# Altium project loapay_test.PrjPcb
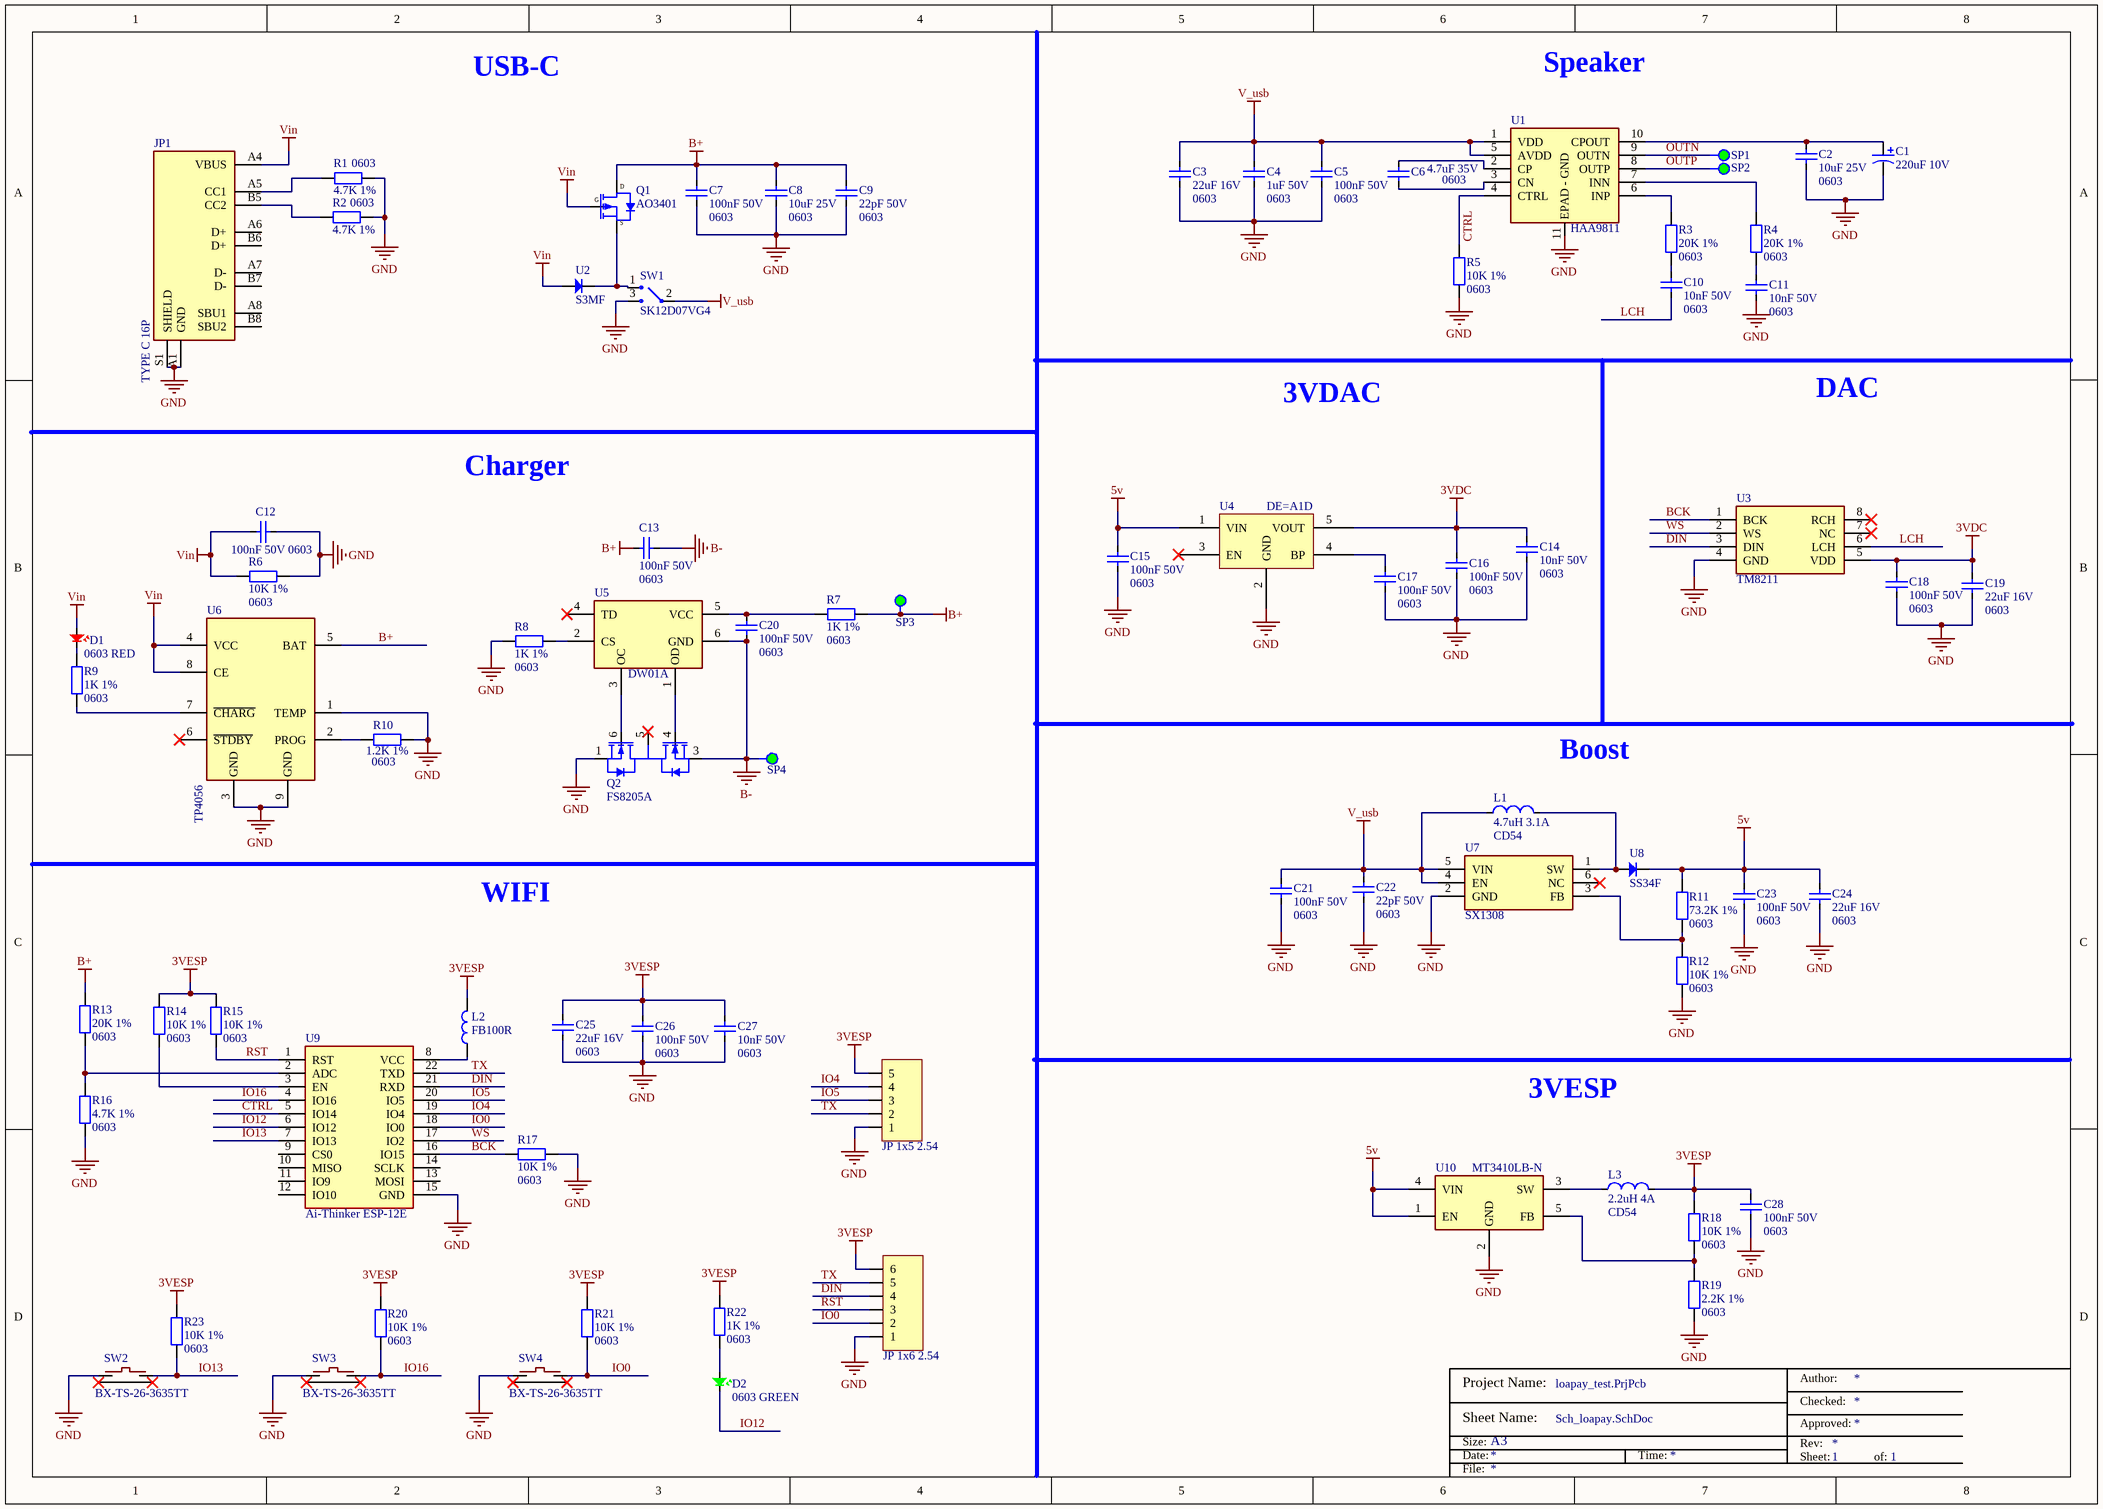
[diagram p0: Sch_loapay.SchDoc]
1 sheet, 79 parts. Net scope: global (net labels, ports and power ports of the same name join across sheets).
Board file: Pcb_loapay.PcbDoc

## Sheet Sch_loapay.SchDoc
size A3; SheetNumber: 1; SheetTotal: 1

### Parts
C1  220uF 10V  [CAP-ALU-SMD-D-NEW]
C2  10uF 25V  Package: 0603  [C0603]
C3  22uF 16V  Package: 0603  [C0603]
C4  1uF 50V  Package: 0603  [C0603]
C5  100nF 50V  Package: 0603  [C0603]
C6  4.7uF 35V  Package: 0603  [C0603]
C7  100nF 50V  Package: 0603  [C0603]
C8  10uF 25V  Package: 0603  [C0603]
C9  22pF 50V  Package: 0603  [C0603]
C10  10nF 50V  Package: 0603  [C0603]
C11  10nF 50V  Package: 0603  [C0603]
C12  100nF 50V  Package: 0603  [C0603]
C13  100nF 50V  Package: 0603  [C0603]
C14  10nF 50V  Package: 0603  [C0603]
C15  100nF 50V  Package: 0603  [C0603]
C16  100nF 50V  Package: 0603  [C0603]
C17  100nF 50V  Package: 0603  [C0603]
C18  100nF 50V  Package: 0603  [C0603]
C19  22uF 16V  Package: 0603  [C0603]
C20  100nF 50V  Package: 0603  [C0603]
C21  100nF 50V  Package: 0603  [C0603]
C22  22pF 50V  Package: 0603  [C0603]
C23  100nF 50V  Package: 0603  [C0603]
C24  22uF 16V  Package: 0603  [C0603]
C25  22uF 16V  Package: 0603  [C0603]
C26  100nF 50V  Package: 0603  [C0603]
C27  10nF 50V  Package: 0603  [C0603]
C28  100nF 50V  Package: 0603  [C0603]
D1  0603 RED  [LED0603_RED]
D2  0603 GREEN  [LED0603_GREEN]
JP1  TYPE C 16P  [TYPE C 16P]
JP2  JP 1x5 2.54  [JP 1x5 DT]
JP3  JP 1x6 2.54  [JP 1x6 DT]
L1  4.7uH 3.1A  [CD54]
L2  FB100R  [L-INDUCTOR 1206]
L3  2.2uH 4A  [CD54]
Q1  AO3401  [SOT-23-3]
Q2  FS8205A  [SOT23-6]
R1  4.7K 1%  Package: 0603  [RES_SMD_0603]
R2  4.7K 1%  Package: 0603  [RES_SMD_0603]
R3  20K 1%  Package: 0603  [RES_SMD_0603]
R4  20K 1%  Package: 0603  [RES_SMD_0603]
R5  10K 1%  Package: 0603  [RES_SMD_0603]
R6  10K 1%  Package: 0603  [RES_SMD_0603]
R7  1K 1%  Package: 0603  [RES_SMD_0603]
R8  1K 1%  Package: 0603  [RES_SMD_0603]
R9  1K 1%  Package: 0603  [RES_SMD_0603]
R10  1.2K 1%  Package: 0603  [RES_SMD_0603]
R11  73.2K 1%  Package: 0603  [RES_SMD_0603]
R12  10K 1%  Package: 0603  [RES_SMD_0603]
R13  20K 1%  Package: 0603  [RES_SMD_0603]
R14  10K 1%  Package: 0603  [RES_SMD_0603]
R15  10K 1%  Package: 0603  [RES_SMD_0603]
R16  4.7K 1%  Package: 0603  [RES_SMD_0603]
R17  10K 1%  Package: 0603  [RES_SMD_0603]
R18  10K 1%  Package: 0603  [RES_SMD_0603]
R19  2.2K 1%  Package: 0603  [RES_SMD_0603]
R20  10K 1%  Package: 0603  [RES_SMD_0603]
R21  10K 1%  Package: 0603  [RES_SMD_0603]
R22  1K 1%  Package: 0603  [RES_SMD_0603]
R23  10K 1%  Package: 0603  [RES_SMD_0603]
SP1  SP  [SOLDERING PAD BIG 2]  (value not drawn)
SP2  SP  [SOLDERING PAD BIG 2]  (value not drawn)
SP3  SP  [SOLDERING PAD BIG 2]  (value not drawn)
SP4  SP  [SOLDERING PAD BIG 2]  (value not drawn)
SW1  SK12D07VG4  [SK12D07VG4]
SW2  BX-TS-26-3635TT  [BX-TS-26-3635TT]
SW3  BX-TS-26-3635TT  [BX-TS-26-3635TT]
SW4  BX-TS-26-3635TT  [BX-TS-26-3635TT]
U1  HAA9811  [ESOP-10]
U2  S3MF  [SMAF_L3.5-W2.6-LS4.7-RD]
U3  TM8211  [SOIC-8]
U4  DE=A1D  [SOT95P260X135-5N]
U5  DW01A  [SOT23-6]
U6  TP4056  [ESOP-8]
U7  SX1308  [SOT23-6]
U8  SS34F  [SMAF_L3.5-W2.6-LS4.7-RD]
U9  Ai-Thinker ESP-12E  [ESP8266-12E]
U10  MT3410LB-N  [SOT23_5]

### Nets
3VDC: C14.2 C16.2 C18.2 C19.2 U3.5(VDD) U4.5(VOUT)
3VESP: C25.2 C26.2 C27.2 C28.2 JP2.5 JP3.6 L2.2 L3.2 R14.1 R15.1 R18.2 R20.1 R21.1 R22.2 R23.1
5v: C15.2 C23.2 C24.2 R11.2 U4.1(VIN) U8.1 U10.1(EN) U10.4(VIN)
B+: C7.2 C8.2 C9.2 C13.1 Q1.3(D) R7.1 R13.2 SP3.1 U6.5(BAT)
B-: C13.2 C20.1 Q2.3(S2) SP4.1 U5.6(GND)
GND: C1.2 C2.1 C3.1 C4.1 C5.1 C7.1 C8.1 C9.1 C11.1 C12.2 C14.1 C15.1 C16.1 C17.1 C18.1 C19.1 C21.1 C22.1 C23.1 C24.1 C25.1 C26.1 C27.1 C28.1 JP1.A1(GND) JP1.S1(SHIELD) JP2.1 JP3.1 Q2.1(S1) R1.2 R2.2 R5.1 R6.2 R8.2 R10.2 R12.1 R16.1 R17.1 R19.1 SW1.3 SW2.1 SW3.1 SW4.1 U1.11(EPAD_-_GND) U3.4(GND) U4.2(GND) U6.1(TEMP) U6.3(GND) U6.9(GND) U7.2(GND) U9.15(GND) U10.2(GND)
V_usb: C3.2 C4.2 C5.2 C21.2 C22.2 L1.1 SW1.2 U1.1(VDD) U1.5(AVDD) U7.4(EN) U7.5(VIN)
Vin: C12.1 D1.1 JP1.A4(VBUS) Q1.1(G) R6.1 U2.2 U6.4(VCC) U6.8(CE)
BCK: R17.2 U3.1(BCK) U9.16(IO15)
CTRL: R5.2 U1.4(CTRL) U9.5(IO14)
DIN: JP3.4 U3.3(DIN) U9.21(RXD)
IO0: JP3.2 R21.2 SW4.2 U9.18(IO0)
IO4: JP2.4 U9.19(IO4)
IO5: JP2.3 U9.20(IO5)
IO12: D2.2 U9.6(IO12)
IO13: R23.2 SW2.2 U9.7(IO13)
IO16: R20.2 SW3.2 U9.4(IO16)
LCH: C10.1 U3.6(LCH)
OUTN: SP1.1 U1.9(OUTN)
OUTP: SP2.1 U1.8(OUTP)
RST: JP3.3 R15.2 U9.1(RST)
TX: JP2.2 JP3.5 U9.22(TXD)
WS: U3.2(WS) U9.17(IO2)
NetC1_1: C1.1 C2.2 U1.10(CPOUT)
NetC6_1: C6.1 U1.3(CN)
NetC6_2: C6.2 U1.2(CP)
NetC10_2: C10.2 R3.1
NetC11_2: C11.2 R4.1
NetC17_2: C17.2 U4.4(BP)
NetC20_2: C20.2 R7.2 U5.5(VCC)
NetD1_2: D1.2 R9.2
NetD2_1: D2.1 R22.1
NetJP1_A5: JP1.A5(CC1) R1.1
NetJP1_B5: JP1.B5(CC2) R2.1
NetL1_2: L1.2 U7.1(SW) U8.2
NetL2_1: L2.1 U9.8(VCC)
NetL3_1: L3.1 U10.3(SW)
NetQ1_2: Q1.2(S) SW1.1 U2.1
NetQ2_4: Q2.4(G2) U5.1(OD)
NetQ2_6: Q2.6(G1) U5.3(OC)
NetR3_2: R3.2 U1.6(INP)
NetR4_2: R4.2 U1.7(INN)
NetR8_1: R8.1 U5.2(CS)
NetR9_1: R9.1 U6.7(~{CHARG})
NetR10_1: R10.1 U6.2(PROG)
NetR11_1: R11.1 R12.2 U7.3(FB)
NetR13_1: R13.1 R16.2 U9.2(ADC)
NetR14_2: R14.2 U9.3(EN)
NetR18_1: R18.1 R19.2 U10.5(FB)

Not connected (* = marked no-connect by the designer): JP1 A6(D+) A7(D-) A8(SBU1) B6(D+) B7(D-) B8(SBU2); Q2 5(D1/D2)*; SW2 3* 4*; SW3 3* 4*; SW4 3* 4*; U3 7(NC)* 8(RCH)*; U4 3(EN)*; U5 4(TD)*; U6 6(~{STDBY})*; U7 6(NC)*; U9 9(CS0) 10(MISO) 11(IO9) 12(IO10) 13(MOSI) 14(SCLK)

### Notes on the sheet
- USB-C
- Speaker
- 3VDAC
- DAC
- Charger
- (near L1) Boost
- WIFI
- 3VESP
- Project Name:
- Author:
- Size:
- Date:
- Sheet Name:
- A3
- Time:
- Checked:
- Approved:
- Rev:
- Sheet:
- of:
- File:

### Library data of the parts
C1 = C_ALU_220uF_10V_D: 220uF 10V ±20% SMD,D6.3xL7.7mm Aluminum Electrolytic Capacitors - SMD ROHS; Manufacturer: Honor Elec; Manufacture Part Number: RVT1A221M0607; Packaging: Cut Tape; Link: https://www.lcsc.com/product-detail/Aluminum-Electrolytic-Capacitors-SMD_Honor-Elec-RVT1A221M0607_C87859.html?s_z=n_220uF; Package: D
C2 C8 = C0603_MLCC_10uF_25V: 25V 10uF X5R ±10% 0603 Multilayer Ceramic Capacitors MLCC - SMD/SMT ROHS; Manufacturer: Murata Electronics; Manufacture Part Number: GRM188R61E106KA73D; Packaging: Cut Tape (CT); Link: https://www.lcsc.com/product-detail/Multilayer-Ceramic-Capacitors-MLCC-SMD-SMT_Murata-Electronics-GRM188R61E106KA73D_C344022.html?s_z=n_10uF%2050V%200603
C3 C19 C24 C25 = C0603_MLCC_22uF_16V: 16V 22uF X5R ±20% 0603 Multilayer Ceramic Capacitors MLCC - SMD/SMT ROHS; Manufacturer: Samsung Electro-Mechanics; Manufacture Part Number: CL10A226MO7JZNC; Packaging: Cut Tape (CT); Link: https://www.lcsc.com/product-detail/Multilayer-Ceramic-Capacitors-MLCC-SMD-SMT_Samsung-Electro-Mechanics-CL10A226MO7JZNC_C2762594.html?s_z=n_22uF%2050V%200603
C4 = C0603_MLCC_1uF_50V: 1 µF ±10% 50V Ceramic Capacitor X5R 0603 (1608 Metric); Manufacturer: Murata Electronics; Manufacture Part Number: GRT188R61H105KE13D; Packaging: Cut Tape (CT); Link: https://www.digikey.com/en/products/detail/murata-electronics/GRT188R61H105KE13D/5416752
C5 C7 C12 C13 C15-C18 C20 C21 C23 C26 C28 = C0603_MLCC_100nF_50V: 50V 100nF X7R ±10% 0603 Multilayer Ceramic Capacitors MLCC - SMD/SMT ROHS; Manufacturer: YAGEO; Manufacture Part Number: CC0603KRX7R9BB104; Packaging: Cut Tape (CT); Link: https://www.lcsc.com/product-detail/Multilayer-Ceramic-Capacitors-MLCC-SMD-SMT_YAGEO-CC0603KRX7R9BB104_C14663.html?s_z=n_100nF%2050V%200603
C6 = C0603_MLCC_4.7uF_35V: 35V 4.7uF X5R ±10% 0603 Multilayer Ceramic Capacitors MLCC - SMD/SMT ROHS; Manufacturer: TDK; Manufacture Part Number: C1608X5R1V475KT000E; Packaging: Cut Tape (CT); Link: https://www.lcsc.com/product-detail/Multilayer-Ceramic-Capacitors-MLCC-SMD-SMT_TDK-C1608X5R1V475KT000E_C329940.html?s_z=n_4.7uF%2050V%200603
C9 C22 = C0603_MLCC_22pF_50V: 50V 22pF NP0 ±5% 0603 Multilayer Ceramic Capacitors MLCC - SMD/SMT ROHS; Manufacturer: YAGEO; Manufacture Part Number: CC0603JRNPO9BN220; Packaging: Cut Tape (CT); Link: https://www.lcsc.com/product-detail/Multilayer-Ceramic-Capacitors-MLCC-SMD-SMT_YAGEO-CC0603JRNPO9BN220_C105620.html?s_z=n_22pF%2050V%200603
C10 C11 C14 C27 = C0603_MLCC_10nF_50V: 50V 10nF X7R ±10% 0603 Multilayer Ceramic Capacitors MLCC - SMD/SMT ROHS; Manufacturer: YAGEO; Manufacture Part Number: CC0603KRX7R9BB103; Packaging: Cut Tape (CT); Link: https://www.lcsc.com/product-detail/Multilayer-Ceramic-Capacitors-MLCC-SMD-SMT_YAGEO-CC0603KRX7R9BB103_C100042.html?s_z=n_10nF%2050V%200603
D1 = L0603_RED: 20mA 330mcd Colorless Transparent Lens -20℃~+85℃ Positive Stick 620nm~630nm Red 120° 50mW 2.3V 0603 LED Indication - Discrete ROHS; Manufacturer: XINGLIGHT; Manufacture Part Number: XL-1608SURC-06; Packaging: Cut Tape (CT); Link: https://www.lcsc.com/product-detail/LED-Indication-Discrete_XINGLIGHT-XL-1608SURC-06_C965799.html?s_z=n_LED%200603%20red; Package: 0603
D2 = L0603_GREEN: 225mcd~450mcd Colorless Transparent Lens -40℃~+85℃ Positive Stick 520nm~535nm Green 120° 70mW 2.4V~3V 0603 LED Indication - Discrete ROHS; Manufacturer: Amicc; Manufacture Part Number: A-SP192DGHC-C01-4T; Packaging: Cut Tape (CT); Link: https://www.lcsc.com/product-detail/LED-Indication-Discrete_Amicc-A-SP192DGHC-C01-4T_C19171301.html?s_z=n_LED%200603%20green; Package: 0603
JP1 = TYPE_C_16P: USB-C (USB TYPE-C) USB 2.0 Receptacle Connector 24 (16+8 Dummy) Position Surface Mount, Right Angle; Through Hole; Manufacturer: Amphenol ICC (Commercial Products); Manufacture Part Number: 12402012E212A; Packaging: Cut Tape; Link: https://www.digikey.cn/en/products/detail/amphenol-cs-commercial-products/12402012E212A/13683192; Package: Plugin
JP2 = JP 1x5 2.54 Duc Thang: Cắm; Ten_Linh_Kien: Jump Đơn Đực 2.54MM 1x40P Thẳng 11MM; Don_Vi: Con; Ma_Hang: MH000903; Ghi_Chu: *; Kieu_Chan: *; Chung_Loai: Cắm
JP3 = JP 1x6 2.54 Duc Thang: Cắm; Ten_Linh_Kien: Jump Đơn Đực 2.54MM 1x40P Thẳng 11MM; Don_Vi: Con; Ma_Hang: MH000903; Ghi_Chu: *; Kieu_Chan: *; Chung_Loai: Cắm
L1 = CD54_4.7uH_3.1A: 3.1A 4.7uH ±20% SMD,5.8x5.2mm Power Inductors ROHS; Manufacturer: Ceaiya; Manufacture Part Number: CD54-4R7M; Packaging: Cut Tape; Link: https://www.lcsc.com/product-detail/Power-Inductors_Ceaiya-CD54-4R7M_C7588991.html?s_z=n_cd54%204.7uH; Inductor: 4.7uH; Current: 3.1A; Package: CD54
L2 = L-Inductor
L3 = CD54_2.2uH_4A: 4A 2.2uH ±20% SMD,5.8x5.2mm Power Inductors ROHS; Manufacturer: Ceaiya; Manufacture Part Number: CD54-2R2M; Packaging: Cut Tape; Link: https://www.lcsc.com/product-detail/Power-Inductors_Ceaiya-CD54-2R2M_C7588989.html?s_z=n_cd54%202.2uH; Inductor: 2.2uH; Current: 4A; Package: CD54
Q1 = AO3401: 30V 4.2A 42mΩ@10V,4A 1.4W 800mV@250uA 1 Piece P-Channel SOT-23 MOSFETs ROHS; Manufacturer: ElecSuper; Manufacture Part Number: AO3401; Packaging: Cut Tape (CT); Link: https://www.lcsc.com/product-detail/MOSFETs_ElecSuper-AO3401_C5224195.html; Drain Source Voltage (Vdss): 30V; Continuous Drain Current (Id): 4.2A; Power Dissipation (Pd): 1.4W; Package: SOT-23-3
Q2 = FS8205A: 20V 25mΩ@2.5V,3A 1.5W 500mV SOT-23-6 MOSFETs ROHS; Manufacturer: TECH PUBLIC; Manufacture Part Number: FS8205A; Packaging: Cut Tape (CT); Link: https://www.lcsc.com/product-detail/MOSFETs_TECH-PUBLIC-FS8205A_C2830320.html?s_z=n_fs8205; Drain to Source Voltage: 20V; RDS(on): 25mΩ@2.5V,3A; Gate Threshold Voltage (Vgs(th)@Id): 500mV; Package: SOT-23-6
R1 R2 R16 = R0603_4.7K: 4.7 kOhms ±1% 0.1W, 1/10W Chip Resistor 0603 (1608 Metric) Moisture Resistant Thick Film; Manufacturer: YAGEO; Manufacture Part Number: RC0603FR-074K7L; Packaging: Cut Tape (CT); Link: https://www.digikey.com/en/products/detail/yageo/RC0603FR-074K7L/727212
R3 R4 R13 = R0603_20K: 20 kOhms ±1% 0.063W, 1/16W Chip Resistor 0402 (1005 Metric) Moisture Resistant Thick Film; Manufacturer: YAGEO; Manufacture Part Number: RC0805FR-0720KL; Packaging: Cut Tape (CT); Link: https://www.digikey.com/en/products/detail/yageo/RC0805FR-0720KL/727720
R5 R6 R12 R14 R15 R17 R18 R20 R21 R23 = R0603_10K: 10 kOhms ±1% 0.1W, 1/10W Chip Resistor 0603 (1608 Metric) Moisture Resistant Thick Film; Manufacturer: YAGEO; Manufacture Part Number: RC0603FR-0710KL; Packaging: Cut Tape (CT); Link: https://www.digikey.com/en/products/detail/yageo/RC0603FR-0710KL/726880
R7-R9 R22 = R0603_1K: 1 kOhms ±1% 0.1W, 1/10W Chip Resistor 0603 (1608 Metric) Moisture Resistant Thick Film; Manufacturer: YAGEO; Manufacture Part Number: RC0603FR-071KL; Packaging: Cut Tape (CT); Link: https://www.digikey.com/en/products/detail/yageo/RC0603FR-071KL/726843
R10 = R0603_1.2K: 1.2 kOhms ±1% 0.1W, 1/10W Chip Resistor 0603 (1608 Metric) Moisture Resistant Thick Film; Manufacturer: YAGEO; Manufacture Part Number: RC0603FR-071K2L; Packaging: Cut Tape (CT); Link: https://www.digikey.com/en/products/detail/yageo/RC0603FR-071K2L/726852
R11 = R0603_73.2K: 73.2 kOhms ±1% 0.1W, 1/10W Chip Resistor 0603 (1608 Metric) Moisture Resistant Thick Film; Manufacturer: YAGEO; Manufacture Part Number: RC0603FR-0773K2L; Packaging: Cut Tape (CT); Link: 73.2 kOhms ±1% 0.1W, 1/10W Chip Resistor 0603 (1608 Metric) Moisture Resistant Thick Film
R19 = R0603_2.2K: 2.2 kOhms ±1% 0.1W, 1/10W Chip Resistor 0603 (1608 Metric) Moisture Resistant Thick Film; Manufacturer: YAGEO; Manufacture Part Number: RC0603FR-072K2L; Packaging: Cut Tape (CT); Link: https://www.digikey.com/en/products/detail/yageo/RC0603FR-072K2L/727016
SP1-SP4 = SOLDERING PAD
SW1 = SK12D07VG4: 500mA SPDT 50V 5千次 Plugin Slide Switches ROHS; Manufacturer: SHOU HAN; Manufacture Part Number: SK12D07VG4; Link: https://www.lcsc.com/product-detail/Slide-Switches_SHOU-HAN-SK12D07VG4_C393937.html; Package: Plugin
SW2-SW4 = BX-TS-26-3635TT: Without bracket 50mA 3.6mm 100000 Times 260gf 12V 3.5mm 3.5mm Rectangle button Standing paste SPST SMD,3x6mm Tactile Switches ROHS; Manufacturer: Bossie; Manufacture Part Number: C18078107; Packaging: Cut Tape; Link: https://www.lcsc.com/product-detail/Tactile-Switches_Bossie-BX-TS-26-3635TT_C18078107.html?s_z=n_tactile; Package: SMD,3x6mm
U1 = HAA9811: Amplifier; Manufacturer: ChipSourceTek Technology; Manufacture Part Number: HAA9811; Packaging: Cut Tape (CT); Package: ESOP-10
U2 = S3MF: 3A Independent Type 1.1V@3A 1kV SMAF Diodes - General Purpose ROHS; Manufacturer: Shandong Jingdao Microelectronics; Manufacture Part Number: S3MF; Packaging: Cut Tape; Link: https://www.lcsc.com/product-detail/Diodes-General-Purpose_Shandong-Jingdao-Microelectronics-S3MF_C123928.html?s_z=n_s3m; Package: SMAF
U3 = TM8211: 3V~8V 16-Bit SOIC-8 Digital to Analog Converters (DAC) ROHS; Manufacturer: TM(Shenzhen Titan Micro Elec); Manufacture Part Number: TM8211; Packaging: Cut Tape (CT); Link: https://www.lcsc.com/product-detail/Digital-to-Analog-Converters-DAC_TM-Shenzhen-Titan-Micro-Elec-TM8211_C92003.html?s_z=n_tm8211; Package: SOIC-8
U4 = DE=A1D: RT9193 on ap
U5 = DW01A: 1V~5.5V SOT-23-6 Battery Management ROHS; Manufacturer: PJSEMI; Manufacture Part Number: DW01A; Packaging: Cut Tape (CT); Link: https://www.lcsc.com/product-detail/Battery-Management_PJSEMI-DW01A_C41398501.html?s_z=n_dw01A; Package: SOT-23-6
U6 = TP4056: ESOP-8 Battery Management ICs ROHS; Manufacturer: MSKSEMI; Manufacture Part Number: TP4056-MS; Packaging: Cut Tape (CT); Link: https://www.lcsc.com/product-detail/Battery-Management_MSKSEMI-TP4056-MS_C7473158.html?s_z=n_tp4056; Package: ESOP-8
U7 = SX1308: Boost type Adjustable 28V 2A 2V~24V SOT-23-6 DC-DC Converters ROHS; Manufacturer: SX(Shenzhen Suosemi Tech); Manufacture Part Number: SX1308; Packaging: Cut Tape; Link: https://www.lcsc.com/product-detail/DC-DC-Converters_SX-Shenzhen-Suosemi-Tech-SX1308_C78162.html?s_z=n_sx1308; Package: SOT-23-6
U8 = SS34F: 40V Independent Type 3A 700mV@3A SMAF Schottky Diodes ROHS; Manufacturer: HXY MOSFET; Manufacture Part Number: SS34F; Packaging: Cut Tape; Link: https://www.lcsc.com/product-detail/Schottky-Diodes_HXY-MOSFET-SS34F_C5766642.html?s_z=n_ss34; Package: SMAF
U9 = Ai-Thinker ESP-12E: -90dBm 16dBm ESP8266 chip On-board PCB antenna 2.4GHz SMD,16x24mm WiFi Modules ROHS; Send Current: 170mA; Receive Current: 56mA; Interface Type: UART;GPIO;ADC;PWM;I2C;SPI; Manufacturer: Ai-Thinker; Manufacture Part Number: ESP-12E; Packaging: Cut Tape (CT); Link: https://www.lcsc.com/product-detail/WiFi-Modules_Ai-Thinker-ESP-12E_C89297.html?s_z=n_ESP-12E; Package: SMD,16x24mm
U10 = MT3410LB-N: SOT-23-5 DC-DC Converters ROHS; Manufacturer: XI'AN Aerosemi Tech; Manufacture Part Number: MT3410LB-N; Packaging: Cut Tape; Link: https://www.lcsc.com/product-detail/DC-DC-Converters_XI-AN-Aerosemi-Tech-MT3410LB-N_C42420805.html?s_z=n_mt3410l; Package: SOT-23-5